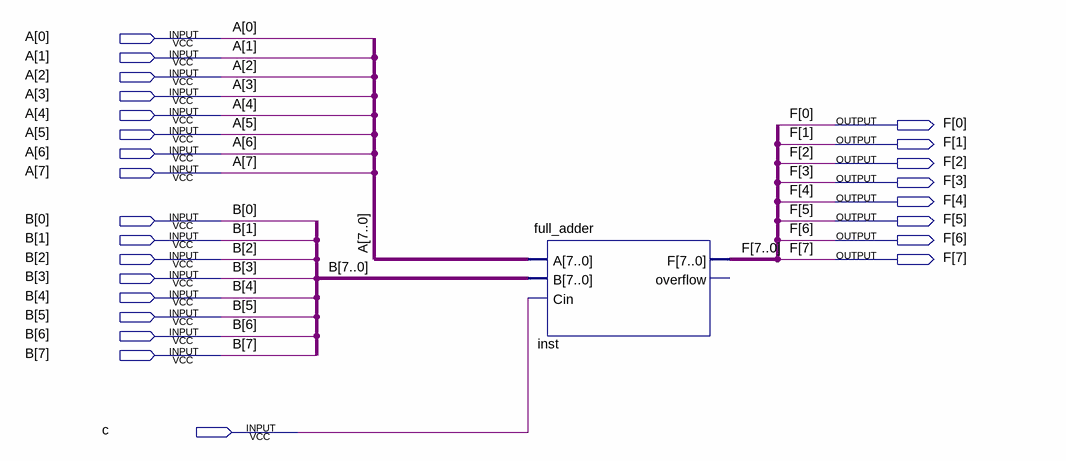
[diagram p0: schematic sheet]
// Quartus schematic adder.bdf as structural Verilog: 1 symbols, 25 pins
module adder (
  input  [7:0] A,
  input  [7:0] B,
  input  c,
  output [7:0] F
);

  full_adder inst (.A(A), .B(B), .Cin(c), .F(F));  // open: overflow
endmodule
